# Altium project HardwareTutorial.PrjPcb
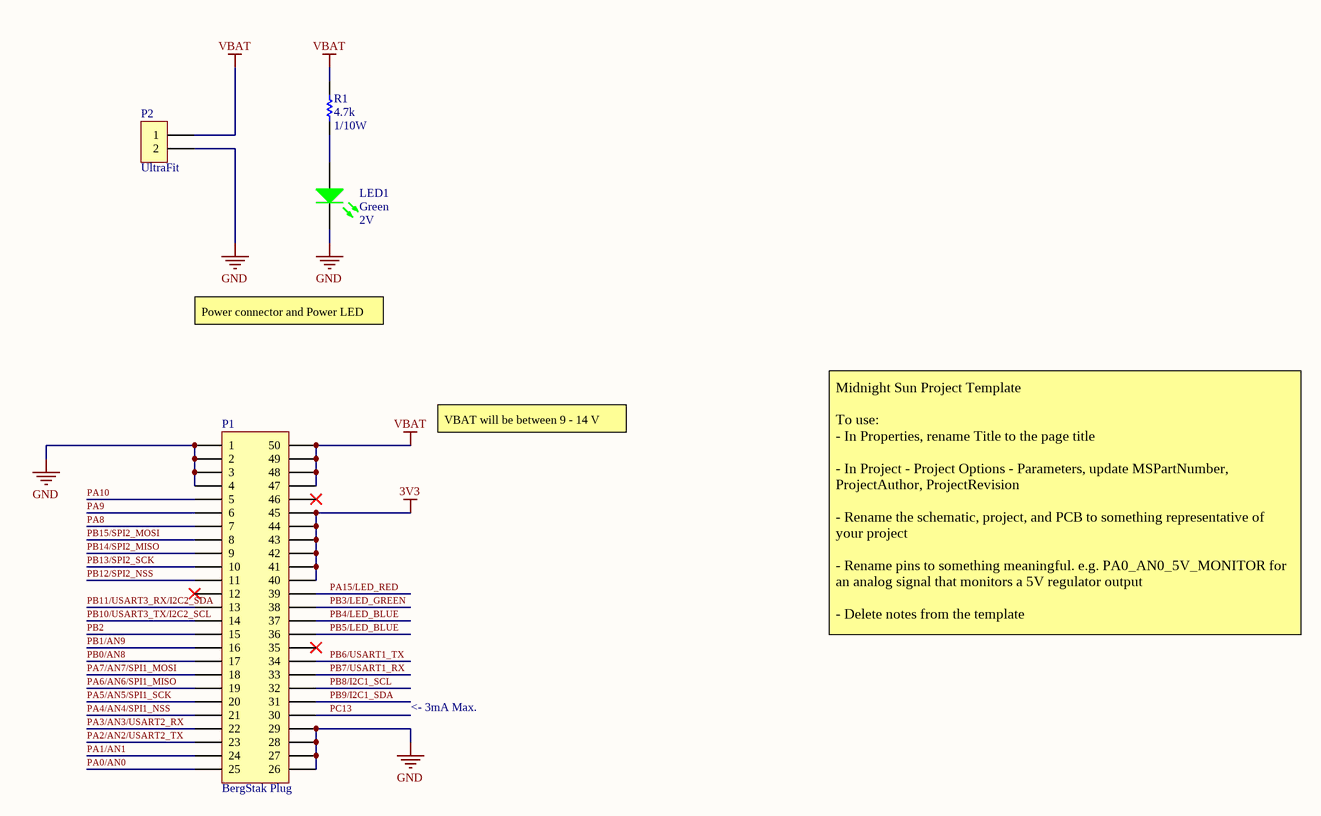
[diagram p0: HardwareTutorial-Controller_Board_Interface.SchDoc]
ProjectRevision: 1.0; ProjectAuthor: Quinn Hodges
1 sheet, 4 parts. Net scope: global (net labels, ports and power ports of the same name join across sheets).
Board file: HardwareTutorial.PcbDoc

## Sheet HardwareTutorial-Controller_Board_Interface.SchDoc: UW Midnight Sun Tutorial - Controller Board Interface
size B; Organization: Midnight Sun Solar Rayce Car Team; Address1: University of Waterloo; Address2: 200 University Ave W; Address3: Waterloo, ON, Canada; Address4: N2L 3E9; Website: www.uwmidsun.com; ProjectName: ProjectName

### Parts
LED1  Color: Green  Voltage - Forward (Vf) (Typ): 2V  [LED_0603]  (hidden comment: LED GREEN CLEAR 2V 0603)
P1  Series: BergStak Plug  [CONN, Bergstak 50 Pos Plug]  (hidden comment: CONN 50POS Bergstak Plug 0.02")
P2  Series: UltraFit  [CONN, 2POS ULTRA-FIT]  (hidden comment: CONN 2POS ULTRA-FIT 0.138")
R1  Resistance (Ohms): 4.7k  Power (Watts): 1/10W  [RES, 0603]  (hidden comment: RES 4.7K OHM 1% 1/10W 0603)

### Nets
3V3: P1.40 P1.41 P1.42 P1.43 P1.44 P1.45
GND: LED1.2(K) P1.1 P1.2 P1.3 P1.4 P1.26 P1.27 P1.28 P1.29 P2.2
VBAT: P1.47 P1.48 P1.49 P1.50 P2.1 R1.1
PA0/AN0: P1.25
PA1/AN1: P1.24
PA2/AN2/USART2_TX: P1.23
PA3/AN3/USART2_RX: P1.22
PA4/AN4/SPI1_NSS: P1.21
PA5/AN5/SPI1_SCK: P1.20
PA6/AN6/SPI1_MISO: P1.19
PA7/AN7/SPI1_MOSI: P1.18
PA8: P1.7
PA9: P1.6
PA10: P1.5
PA15/LED_RED: P1.39
PB0/AN8: P1.17
PB1/AN9: P1.16
PB2: P1.15
PB3/LED_GREEN: P1.38
PB4/LED_BLUE: P1.37
PB5/LED_BLUE: P1.36
PB6/USART1_TX: P1.34
PB7/USART1_RX: P1.33
PB8/I2C1_SCL: P1.32
PB9/I2C1_SDA: P1.31
PB10/USART3_TX/I2C2_SCL: P1.14
PB11/USART3_RX/I2C2_SDA: P1.13
PB12/SPI2_NSS: P1.11
PB13/SPI2_SCK: P1.10
PB14/SPI2_MISO: P1.9
PB15/SPI2_MOSI: P1.8
PC13: P1.30
NetLED1_1: LED1.1(A) R1.2

Not connected (* = marked no-connect by the designer): P1 12* 35* 46*

### Notes on the sheet
- Power connector and Power LED
- VBAT will be between 9 - 14 V
- Midnight Sun Project Template
  To use:
  - In Properties, rename Title to the page title
  - In Project - Project Options - Parameters, update MSPartNumber, ProjectAuthor, ProjectRevision
  - Rename the schematic, project, and PCB to something representative of your project
  - Rename pins to something meaningful. e.g. PA0_AN0_5V_MONITOR for an analog signal that monitors a 5V regulator output
  - Delete notes from the template
- <- 3mA Max.
- PROJECT
- DOCUMENT
- DRAWN BY
- LAST MODIFIED
- PART NUMBER
- REVISION
- SHEET
- VARIANT
- OF
- Engineering 5 - 1002
  University of Waterloo
  (519) 888-4567 x32978
  hardware@uwmidsun.com

### Library data of the parts
LED1 = LED GREEN CLEAR 2V 0603: Green 572nm LED Indication - Discrete 2V 0603 (1608 Metric); Manufacturer: Wurth Electronics Inc.; Manufacturer Part Number: 150060VS75000; Lens Color: Colorless; Millicandela Rating: 40mcd; Lens Style/Size: Rectangle with Flat Top, 1.10mm x 0.70mm; Current - Test: 20mA; Viewing Angle: 140°; Wavelength - Dominant: 570nm; Supplier 1: Digi-Key; RoHS: RoHS Compliant; Category: Optoelectronics; Stock 1: 9408; Pricing 1: 1=0.21, 100=0.1617, 500=0.13964 (CAD); Packaging: Cut Tape (CT); Part Status: Active; Lens Transparency: Clear; Mounting Type: Surface Mount; Wavelength - Peak: 572nm; Features: -; Package / Case: 0603 (1608 Metric); Supplier Device Package: 0603; Size / Dimension: 1.60mm L x 0.80mm W; Height (Max): 0.80mm; ComponentLink1URL: http://katalog.we-online.de/led/datasheet/150060VS75000.pdf; ComponentLink1Description: http://katalog.we-online.de/led/datasheet/150060VS75000.pdf; Supplier Part Number 1: 732-4980-1-ND
P1 = CONN 50POS Bergstak Plug 0.02": 50 Position Connector Plug, Outer Shroud Contacts Surface Mount Gold; Manufacturer 1: Amphenol FCI; Manufacturer Part Number 1: 10132797-055100LF; Number of Positions: 50; Mated Stacking Heights: 5mm; Pitch: 0.020" (0.50mm); Supplier 1: Digi-Key; Supplier Part Number 1: 609-5226-1-ND; Packaging: Cut Tape (CT); Part Status: Active; Connector Type: Plug, Outer Shroud Contacts; Number of Rows: 2; Mounting Type: Surface Mount; Contact Finish: Gold; Contact Finish Thickness: 1µin (0.025µm); Height Above Board: 0.169" (4.30mm); ComponentLink1URL: http://portal.fciconnect.com/Comergent//fci/drawing/10132797.pdf; ComponentLink1Description: http://portal.fciconnect.com/Comergent//fci/drawing/10132797.pdf
P2 = CONN 2POS ULTRA-FIT 0.138": Connector Header Through Hole 2 position 0.138" (3.50mm); Manufacturer: Molex; Manufacturer Part Number: 1722871102; Number of Positions: 2; Connector Type: Male Pin; Pitch: 0.138inch; ComponentLink1URL: http://www.molex.com/pdm_docs/sd/1722861302_sd.pdf; ComponentLink1Description: http://www.molex.com/pdm_docs/sd/1722861302_sd.pdf; Supplier 1: Digi-Key; RoHS: Yes; Stock 1: 2743; Pricing 1: 1 = 0.78000, 10 = 0.68800, 100 = 0.59380, 500 = 0.48582, 1000 = 0.43184, 5000 = 0.37786, 10000 = 0.35897 (USD); Mount: Through Hole; Color: Black; Contact Plating: Tin; Packaging: Tray; Number of Rows: 1; Termination: Solder; Fastening Type: Latch; Supplier Part Number 1: WM11701-ND
R1 = RES 4.7K OHM 1% 1/10W 0603: 4.7k Ohm ±1% 0.1W, 1/10W Chip Resistor 0603 (1608 Metric) Moisture Resistant Thick Film; Manufacturer 1: Yageo; Manufacturer Part Number 1: RC0603FR-074K7L; Description 1: RES SMD 4.7K OHM 1% 1/10W 0603; Temperature Coefficient: ±100ppm/°C; Supplier 1: Digi-Key; Supplier Part Number 1: 311-4.70KHRCT-ND; RoHS: RoHS Compliant; Category: Resistors; Stock 1: 3487566; Pricing 1: 1=0.16, 10=0.022, 100=0.0089, 1000=0.00402, 2500=0.00349 (CAD); Packaging: Cut Tape (CT); Part Status: Active; Composition: Thick Film; Features: Moisture Resistant; Operating Temperature: -55°C ~ 155°C; Package / Case: 0603 (1608 Metric); Supplier Device Package: 0603; Size / Dimension: 0.063" L x 0.031" W (1.60mm x 0.80mm); Height - Seated (Max): 0.022" (0.55mm); Failure Rate: -; ComponentLink1URL: http://www.yageo.com/documents/recent/PYu-RC_Group_51_RoHS_L_7.pdf; ComponentLink1Description: http://www.yageo.com/documents/recent/PYu-RC_Group_51_RoHS_L_7.pdf; Tolerance: ±1%